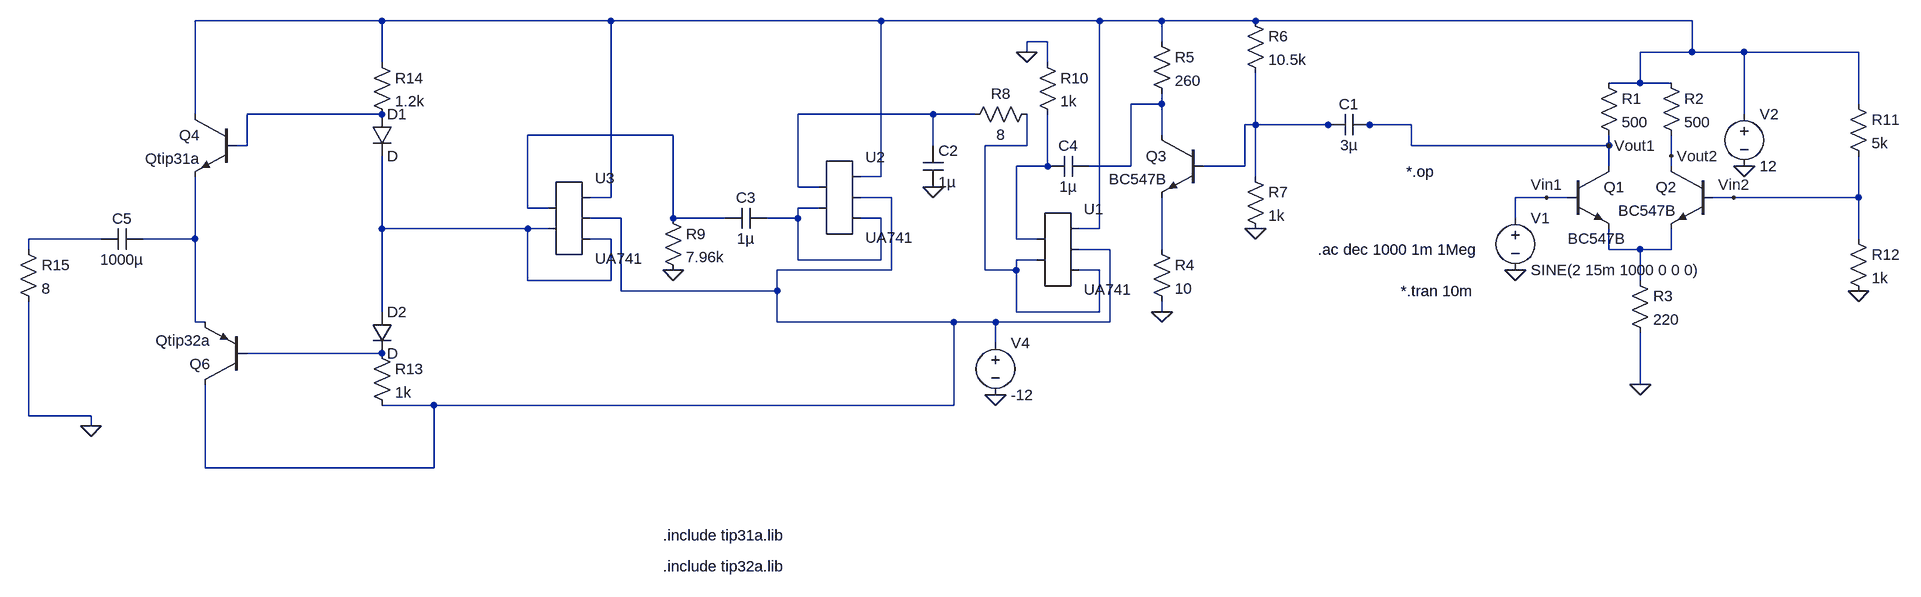
[diagram p0: schematic Audio_Amplifier.asc]
Audio_Amplifier.asc, the LTspice schematic file:
Version 4
SHEET 1 948 888
WIRE -1504 32 -1792 32
WIRE -1152 32 -1504 32
WIRE -736 32 -1152 32
WIRE -400 32 -736 32
WIRE -304 32 -400 32
WIRE -160 32 -304 32
WIRE 512 32 -160 32
WIRE -480 64 -512 64
WIRE -304 64 -304 32
WIRE -512 80 -512 64
WIRE 512 80 512 32
WIRE 512 80 432 80
WIRE 592 80 512 80
WIRE 768 80 592 80
WIRE -1504 96 -1504 32
WIRE -480 96 -480 64
WIRE 432 128 432 80
WIRE 432 128 384 128
WIRE 480 128 432 128
WIRE -304 160 -304 144
WIRE -304 160 -352 160
WIRE 768 160 768 80
WIRE -1792 176 -1792 32
WIRE -1504 176 -1712 176
WIRE -656 176 -864 176
WIRE -592 176 -656 176
WIRE 592 176 592 80
WIRE -160 192 -160 112
WIRE -160 192 -176 192
WIRE -48 192 -160 192
WIRE -32 192 -48 192
WIRE 16 192 0 192
WIRE 80 192 16 192
WIRE -1056 208 -1280 208
WIRE -304 208 -304 160
WIRE -1712 224 -1712 176
WIRE -1712 224 -1728 224
WIRE -656 224 -656 176
WIRE -512 224 -512 176
WIRE -512 224 -576 224
WIRE 80 224 80 192
WIRE 384 224 384 208
WIRE 384 224 80 224
WIRE 480 240 480 208
WIRE -480 256 -480 176
WIRE -480 256 -528 256
WIRE -352 256 -352 160
WIRE -352 256 -416 256
WIRE -176 256 -176 192
WIRE -176 256 -240 256
WIRE 384 256 384 224
WIRE 480 256 480 240
WIRE -736 272 -736 32
WIRE -736 272 -768 272
WIRE -160 272 -160 192
WIRE -864 288 -864 176
WIRE -832 288 -864 288
WIRE -1152 304 -1152 32
WIRE -1152 304 -1184 304
WIRE -720 304 -768 304
WIRE 288 304 240 304
WIRE 320 304 288 304
WIRE 576 304 544 304
WIRE 768 304 768 240
WIRE 768 304 576 304
WIRE -1280 320 -1280 208
WIRE -1248 320 -1280 320
WIRE -832 320 -864 320
WIRE -1136 336 -1184 336
WIRE -1056 336 -1056 208
WIRE -976 336 -1056 336
WIRE -864 336 -864 320
WIRE -864 336 -912 336
WIRE -736 336 -768 336
WIRE 240 336 240 304
WIRE -1504 352 -1504 240
WIRE -1280 352 -1504 352
WIRE -1248 352 -1280 352
WIRE -400 352 -400 32
WIRE -400 352 -432 352
WIRE -1936 368 -2048 368
WIRE -1792 368 -1792 272
WIRE -1792 368 -1872 368
WIRE -1152 368 -1184 368
WIRE -528 368 -528 256
WIRE -496 368 -528 368
WIRE 768 368 768 304
WIRE -2048 384 -2048 368
WIRE -384 384 -432 384
WIRE -304 384 -304 304
WIRE 384 384 384 352
WIRE 432 384 384 384
WIRE 480 384 480 352
WIRE 480 384 432 384
WIRE -864 400 -864 336
WIRE -736 400 -736 336
WIRE -736 400 -864 400
WIRE -496 400 -528 400
WIRE -720 416 -720 304
WIRE -720 416 -896 416
WIRE -576 416 -576 224
WIRE -528 416 -528 400
WIRE -528 416 -576 416
WIRE -400 416 -432 416
WIRE -1280 432 -1280 352
WIRE -1152 432 -1152 368
WIRE -1152 432 -1280 432
WIRE 432 432 432 384
WIRE -1136 448 -1136 336
WIRE -896 448 -896 416
WIRE -896 448 -1136 448
WIRE -1504 480 -1504 352
WIRE -528 480 -528 416
WIRE -400 480 -400 416
WIRE -400 480 -528 480
WIRE -304 480 -304 464
WIRE -1792 496 -1792 368
WIRE -1776 496 -1792 496
WIRE -896 496 -896 448
WIRE -624 496 -896 496
WIRE -560 496 -624 496
WIRE -384 496 -384 384
WIRE -384 496 -560 496
WIRE -560 528 -560 496
WIRE -1504 544 -1712 544
WIRE 432 592 432 512
WIRE -1424 624 -1504 624
WIRE -624 624 -624 496
WIRE -624 624 -1424 624
WIRE -2048 640 -2048 464
WIRE -1952 640 -2048 640
WIRE -1952 656 -1952 640
WIRE -1776 720 -1776 592
WIRE -1424 720 -1424 624
WIRE -1424 720 -1776 720
FLAG 240 416 0
FLAG 592 256 0
FLAG 288 304 Vin1
FLAG 576 304 Vin2
FLAG 384 224 Vout1
FLAG 480 240 Vout2
FLAG -304 480 0
FLAG -160 352 0
FLAG -656 288 0
FLAG -560 608 0
FLAG -1056 416 0
FLAG -512 80 0
FLAG 432 592 0
FLAG 768 448 0
FLAG -1952 656 0
SYMBOL Voltage 240 320 R0
SYMATTR InstName V1
SYMATTR Value SINE(2 15m 1000 0 0 0)
SYMATTR Value2 AC 1
SYMBOL Voltage 592 160 R0
SYMATTR InstName V2
SYMATTR Value 12
SYMBOL npn 320 256 R0
WINDOW 3 1 111 Left 2
SYMATTR Value BC547B
SYMATTR InstName Q1
SYMBOL npn 544 256 M0
SYMATTR InstName Q2
SYMATTR Value BC547B
SYMBOL Res 368 112 R0
SYMATTR InstName R1
SYMATTR Value 500
SYMBOL Res 464 112 R0
SYMATTR InstName R2
SYMATTR Value 500
SYMBOL Res 416 416 R0
SYMATTR InstName R3
SYMATTR Value 220
SYMBOL npn -240 208 M0
SYMATTR InstName Q3
SYMATTR Value BC547B
SYMBOL Res -320 368 R0
SYMATTR InstName R4
SYMATTR Value 10
SYMBOL Res -320 48 R0
SYMATTR InstName R5
SYMATTR Value 260
SYMBOL Res -176 16 R0
SYMATTR InstName R6
SYMATTR Value 10.5k
SYMBOL Res -176 256 R0
SYMATTR InstName R7
SYMATTR Value 1k
SYMBOL Cap 16 176 R90
WINDOW 0 0 32 VBottom 2
WINDOW 3 32 32 VTop 2
SYMATTR InstName C1
SYMATTR Value 3µ
SYMBOL Res -496 160 R90
WINDOW 0 0 56 VBottom 2
WINDOW 3 32 56 VTop 2
SYMATTR InstName R8
SYMATTR Value 8
SYMBOL Cap -672 224 R0
SYMATTR InstName C2
SYMATTR Value 1µ
SYMBOL AutoGenerated/UA741 -464 384 R0
SYMATTR InstName U1
SYMBOL Voltage -560 512 R0
SYMATTR InstName V4
SYMATTR Value -12
SYMBOL AutoGenerated/UA741 -800 304 R0
SYMATTR InstName U2
SYMBOL Cap -912 320 R90
WINDOW 0 0 32 VBottom 2
WINDOW 3 32 32 VTop 2
SYMATTR InstName C3
SYMATTR Value 1µ
SYMBOL Res -1072 320 R0
SYMATTR InstName R9
SYMATTR Value 7.96k
SYMBOL Cap -416 240 R90
WINDOW 0 0 32 VBottom 2
WINDOW 3 32 32 VTop 2
SYMATTR InstName C4
SYMATTR Value 1µ
SYMBOL Res -496 80 R0
SYMATTR InstName R10
SYMATTR Value 1k
SYMBOL Res 752 144 R0
SYMATTR InstName R11
SYMATTR Value 5k
SYMBOL Res 752 352 R0
SYMATTR InstName R12
SYMATTR Value 1k
SYMBOL AutoGenerated/UA741 -1216 336 R0
SYMATTR InstName U3
SYMBOL Diode -1520 176 R0
SYMATTR InstName D1
SYMBOL Diode -1520 480 R0
SYMATTR InstName D2
SYMBOL Res -1520 528 R0
SYMATTR InstName R13
SYMATTR Value 1k
SYMBOL Res -1520 80 R0
SYMATTR InstName R14
SYMATTR Value 1.2k
SYMBOL npn -1728 176 M0
SYMATTR InstName Q4
SYMATTR Value Qtip31a
SYMBOL pnp -1712 592 R180
SYMATTR InstName Q6
SYMATTR Value Qtip32a
SYMBOL Cap -1872 352 R90
WINDOW 0 0 32 VBottom 2
WINDOW 3 32 32 VTop 2
SYMATTR InstName C5
SYMATTR Value 1000µ
SYMBOL Res -2064 368 R0
SYMATTR InstName R15
SYMATTR Value 8
TEXT 64 448 Left 2 !*.tran 10m
TEXT -64 384 Left 2 !.ac dec 1000 1m 1Meg
TEXT 72 264 Left 2 !*.op
TEXT -1072 824 Left 2 !.include tip31a.lib
TEXT -1072 872 Left 2 !.include tip32a.lib

The netlist it stands for:
* Audio_Amplifier.asc
V1 Vin1 0 SINE(2 15m 1000 0 0 0) AC 1
V2 N001 0 12
Q1 Vout1 Vin1 N015 0 BC547B
Q2 Vout2 Vin2 N015 0 BC547B
R1 N001 Vout1 500
R2 N001 Vout2 500
R3 N015 0 220
Q3 N002 N005 N014 0 BC547B
R4 N014 0 10
R5 N001 N002 260
R6 N001 N005 10.5k
R7 N005 0 1k
C1 Vout1 N005 3µ
R8 N007 N004 8
C2 N004 0 1µ
* U1: UA741 (symbol AutoGenerated/UA741 not available, pins judged from their places): pin1=N008 pin2=N007 pin3=N001 pin4=N009 pin5=N007
V4 N009 0 -12
* U2: UA741 (symbol AutoGenerated/UA741 not available, pins judged from their places): pin1=N004 pin2=N010 pin3=N001 pin4=N009 pin5=N010
C3 N010 N006 1µ
R9 N006 0 7.96k
C4 N002 N008 1µ
R10 0 N008 1k
R11 N001 Vin2 5k
R12 Vin2 0 1k
* U3: UA741 (symbol AutoGenerated/UA741 not available, pins judged from their places): pin1=N006 pin2=N011 pin3=N001 pin4=N009 pin5=N011
D1 N003 N011 D
D2 N011 N016 D
R13 N016 N009 1k
R14 N001 N003 1.2k
Q4 N001 N003 N013 0 Qtip31a
Q6 N009 N016 N013 0 Qtip32a
C5 N013 N012 1000µ
R15 N012 0 8
.model D D
.lib standard.dio
.model NPN NPN
.model PNP PNP
.lib standard.bjt
*.tran 10m
.ac dec 1000 1m 1Meg
*.op
.include tip31a.lib
.include tip32a.lib
.backanno
.end